# Altium schematic sheet ADCClick.SchDoc
size A
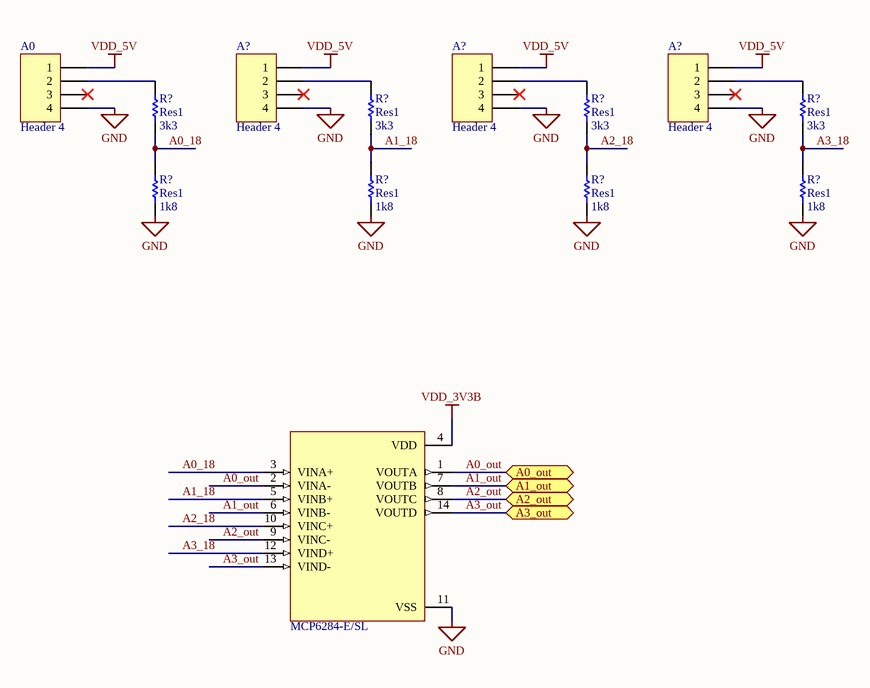
[diagram p0: ADCClick.SchDoc]

## Parts
(Parts that share a designator on the sheet are numbered #1, #2 ... from top to bottom, then left to right.)
?  MCP6284-E/SL  [SOIC127P600X175-14N]
A0  Header 4  [HDR1X4]
A?#1  Header 4  [HDR1X4]
A?#2  Header 4  [HDR1X4]
A?#3  Header 4  [HDR1X4]
R?#1  Res1  value 3k3  [AXIAL-0.3]
R?#2  Res1  value 3k3  [AXIAL-0.3]
R?#3  Res1  value 3k3  [AXIAL-0.3]
R?#4  Res1  value 3k3  [AXIAL-0.3]
R?#5  Res1  value 1k8  [AXIAL-0.3]
R?#6  Res1  value 1k8  [AXIAL-0.3]
R?#7  Res1  value 1k8  [AXIAL-0.3]
R?#8  Res1  value 1k8  [AXIAL-0.3]

## Ports
A0_out, A1_out, A2_out, A3_out

## Nets
GND: ?.11(VSS) A0.4 A?#1.4 A?#2.4 A?#3.4 R?#5.2 R?#6.2 R?#7.2 R?#8.2
VDD_3V3B: ?.4(VDD)
VDD_5V: A0.1 A?#1.1 A?#2.1 A?#3.1
A0_18: ?.3(VINA+) R?#1.2 R?#5.1
A0_out: ?.1(VOUTA) ?.2(VINA-) ; port A0_out
A1_18: ?.5(VINB+) R?#2.2 R?#6.1
A1_out: ?.6(VINB-) ?.7(VOUTB) ; port A1_out
A2_18: ?.10(VINC+) R?#3.2 R?#7.1
A2_out: ?.8(VOUTC) ?.9(VINC-) ; port A2_out
A3_18: ?.12(VIND+) R?#4.2 R?#8.1
A3_out: ?.13(VIND-) ?.14(VOUTD) ; port A3_out
NetA0_2: A0.2 R?#1.1
NetA?#1_2: A?#1.2 R?#2.1
NetA?#2_2: A?#2.2 R?#3.1
NetA?#3_2: A?#3.2 R?#4.1

Not connected (* = marked no-connect by the designer): A0 3*; A?#1 3*; A?#2 3*; A?#3 3*

## Library data of the parts
? = MCP6284-E/SL: General Purpose Amplifier 4 Circuit Rail-to-Rail 14-SOIC; Vendor Part Number: MCP6284-E/SL-ND; MF: Microchip; Value: *; SnapEDA_Link: https://www.snapeda.com/parts/MCP6284-E/SL/Microchip/view-part/282490/?ref=snap; MP: MCP6284-E/SL; Availability: Warning; Mouser-Purchase-URL: https://snapeda.com/shop?store=Mouser&id=282490; Price: None; DigiKey-Purchase-URL: https://snapeda.com/shop?store=DigiKey&id=282490; Package: SOIC-14 Microchip; Manufacturer Part Number: MCP6284-E/SL
A0 A?#1-A?#3 = Header 4: Header, 4-Pin; LatestRevisionDate: 17-Jul-2002; LatestRevisionNote: Re-released for DXP Platform.; Publisher: Altium Limited
R?#1-R?#8 = Res1: Resistor; Published: 8-Jun-2000; LatestRevisionDate: 17-Jul-2002; LatestRevisionNote: Re-released for DXP Platform.; PackageReference: AXIAL-0.3; Publisher: Altium Limited; PackageDescription: Axial Device, Thru-Hole; 2 Leads; 0.3 in Pin Spacing